# Altium project DE-110817.PrjPcb
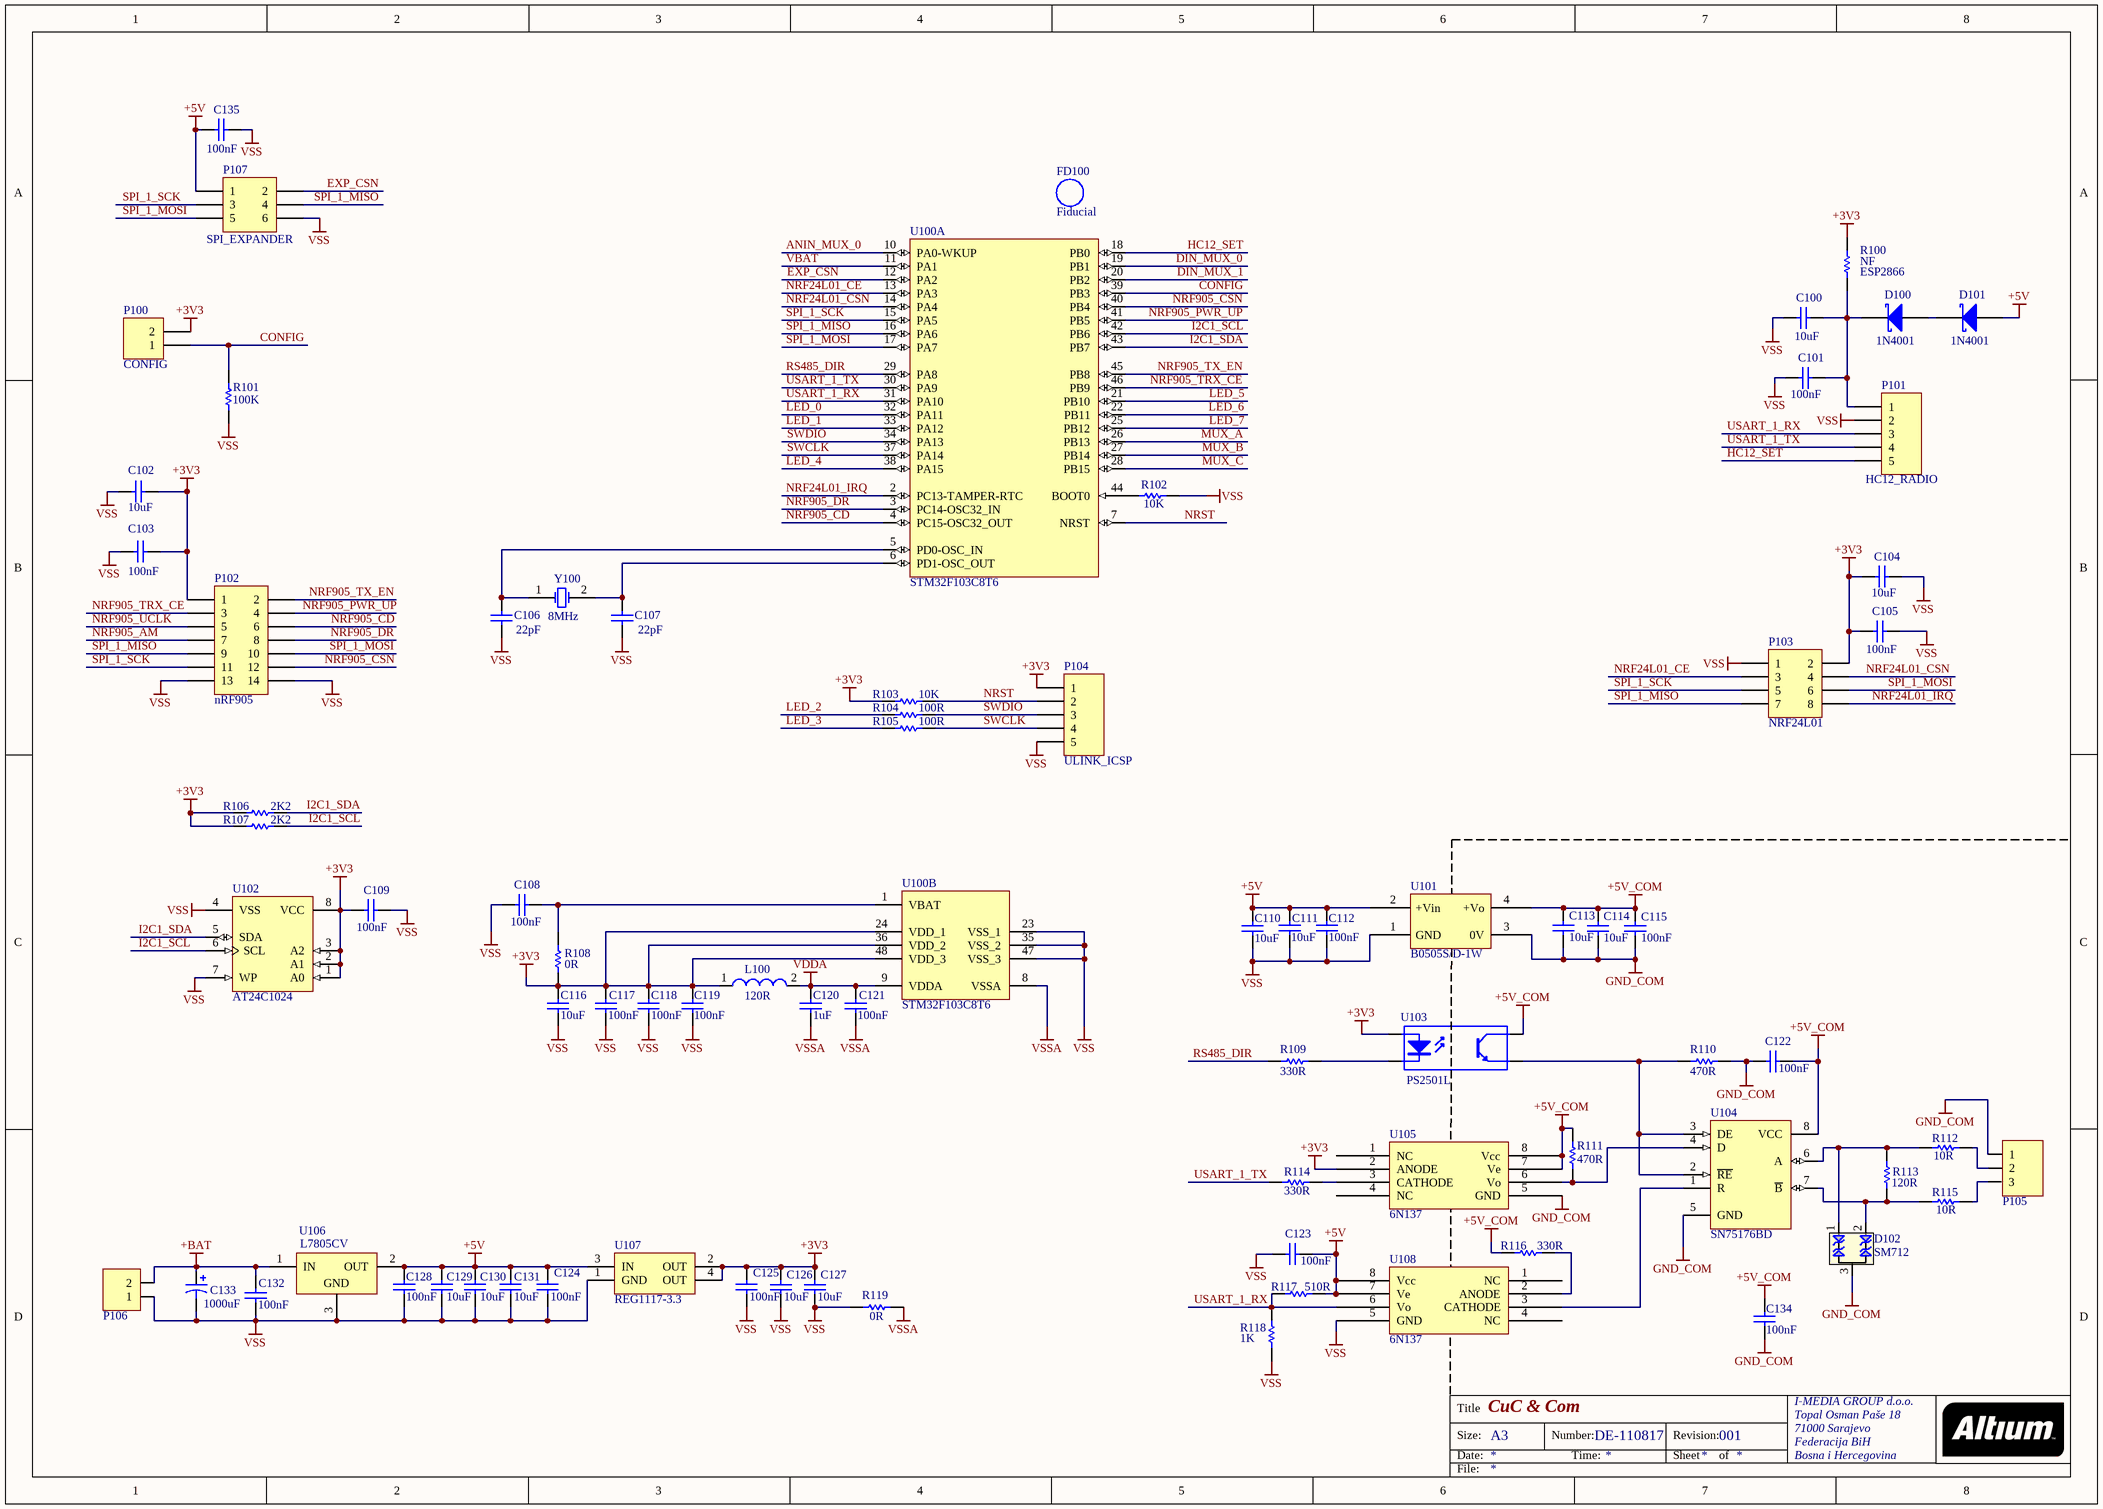
[diagram p0: DE-110817_01.SchDoc]
2 sheets, 204 parts. Net scope: global (net labels, ports and power ports of the same name join across sheets).
Board file: DE-110817.PcbDoc
Sheets:
  DE-110817_01.SchDoc
  DE-110817_02.SchDoc

## Sheet DE-110817_01.SchDoc: CuC & Com
size A3; Author: eldar6776@hotmail.com; DrawnBy: Eldar Dedic; Organization: I-MEDIA GROUP d.o.o.; Address1: Topal Osman Paše 18; Address2: 71000 Sarajevo; Address3: Federacija BiH; Address4: Bosna i Hercegovina; DocumentNumber: DE-110817; Revision: 001

### Parts
C100  10uF  [0805]
C101  100nF  [0603]
C102  10uF  [0805]
C103  100nF  [0603]
C104  10uF  [0805]
C105  100nF  [0603]
C106  22pF  [0603]
C107  22pF  [0603]
C108  100nF  [0603]
C109  100nF  [0603]
C110  10uF  [0805]
C111  10uF  [0805]
C112  100nF  [0603]
C113  10uF  [0805]
C114  10uF  [0805]
C115  100nF  [0603]
C116  10uF  [0805]
C117  100nF  [0603]
C118  100nF  [0603]
C119  100nF  [0603]
C120  1uF  [0603]
C121  100nF  [0603]
C122  100nF  [0603]
C123  100nF  [0603]
C124  100nF  [0603]
C125  100nF  [0603]
C126  10uF  [0805]
C127  10uF  [0805]
C128  100nF  [0603]
C129  10uF  [0805]
C130  10uF  [0805]
C131  10uF  [0805]
C132  100nF  [0603]
C133  1000uF  [CAPPR5-10x16]
C134  100nF  [0603]
C135  100nF  [0603]
D100  1N4001  [SMA]
D101  1N4001  [SMA]
D102  SM712  [SOT23_3L]
FD100  Fiducial  [Fiducial]  (no BOM)
L100  120R  [SMD-0805]
P100  CONFIG  [HDR1X2]
P101  HC12_RADIO  [HDR1X5]
P102  nRF905  [HDR2X7]
P103  NRF24L01  [HDR2X4]
P104  ULINK_ICSP  [HDR1X5]
P105  TERMINAL BLOK 3  [TERMINAL BLOK 3]  (value not drawn)
P106  TERMINAL BLOK 2  [TERMINAL BLOK 2]  (value not drawn)
P107  SPI_EXPANDER  [HDR2X3]
R100  NF  [ERA-0603]
R101  100K  [ERA-0603]
R102  10K  [ERA-0603]
R103  10K  [ERA-0603]
R104  100R  [ERA-0603]
R105  100R  [ERA-0603]
R106  2K2  [ERA-0603]
R107  2K2  [ERA-0603]
R108  0R  [ERA-0603]
R109  330R  [ERA-0603]
R110  470R  [ERA-0603]
R111  470R  [ERA-0603]
R112  10R  [ERA-0805]
R113  120R  [ERA-0805]
R114  330R  [ERA-0603]
R115  10R  [ERA-0805]
R116  330R  [ERA-0603]
R117  510R  [ERA-0603]
R118  1K  [ERA-0603]
R119  0R  [ERA-0603]
U100  STM32F103C8T6  [STM-LQFP48_N]  (parts A,B of 2)
U101  B0505S/D-1W  [B0505S-1W]
U102  AT24C1024  [SOIC-SN8_N]
U103  PS2501L  [SOP4]
U104  SN75176BD  [D008_L]
U105  6N137  [SMD-8]
U106  L7805CV  [TO220ABN]
U107  REG1117-3.3  [ZZ311]
U108  6N137  [SMD-8]
Y100  8MHz  [HC49/4H_SMX]

### Nets
+3V3: C102.1 C103.1 C104.1 C105.1 C109.1 C116.2 C117.2 C118.2 C119.2 C125.2 C126.2 C127.2 L100.1 P100.2 P102.1 P103.2 P104.1 R100.2 R103.2 R106.1 R107.1 R108.2 U100.24(VDD_1) U100.36(VDD_2) U100.48(VDD_3) U102.1(A0) U102.2(A1) U102.3(A2) U102.8(VCC) U103.1(A) U105.2(ANODE) U107.2(OUT) U107.4(OUT)
+5V: C110.2 C111.2 C112.2 C123.1 C124.2 C128.2 C129.2 C130.2 C131.2 C135.2 D101.1(A) P107.1 R117.1 U101.2(+Vin) U106.2(OUT) U107.3(IN) U108.7(Ve) U108.8(Vcc)
+5V_COM: C113.2 C114.2 C115.2 C122.2 C134.1 R111.1 R116.2 U101.4(+Vo) U103.4(C) U104.8(VCC) U105.7(Ve) U105.8(Vcc)
+BAT: C132.2 C133.1 P106.2 U106.1(IN)
GND_COM: C113.1 C114.1 C115.1 C122.1 C134.2 D102.3(GND) P105.1 R110.2 U101.3(0V) U104.5(GND) U105.5(GND)
VDDA: C120.2 C121.2 L100.2 U100.9(VDDA)
VSS: C100.2 C101.2 C102.2 C103.2 C104.2 C105.2 C106.1 C107.1 C108.2 C109.2 C110.1 C111.1 C112.1 C116.1 C117.1 C118.1 C119.1 C123.2 C124.1 C125.1 C126.1 C127.1 C128.1 C129.1 C130.1 C131.1 C132.1 C133.2 C135.1 P101.2 P102.13 P102.14 P103.1 P104.5 P106.1 P107.6 R101.1 R102.2 R118.1 R119.1 U100.23(VSS_1) U100.35(VSS_2) U100.47(VSS_3) U101.1(GND) U102.4(VSS) U102.7(WP) U106.3(GND) U107.1(GND) U108.5(GND)
VSSA: C120.1 C121.1 R119.2 U100.8(VSSA)
ANIN_MUX_0: U100.10(PA0-WKUP)
CONFIG: P100.1 R101.2 U100.39(PB3)
DIN_MUX_0: U100.19(PB1)
DIN_MUX_1: U100.20(PB2)
EXP_CSN: P107.2 U100.12(PA2)
HC12_SET: P101.5 U100.18(PB0)
I2C1_SCL: R107.2 U100.42(PB6) U102.6(SCL)
I2C1_SDA: R106.2 U100.43(PB7) U102.5(SDA)
LED_0: U100.32(PA11)
LED_1: U100.33(PA12)
LED_2: R104.2
LED_3: R105.2
LED_4: U100.38(PA15)
LED_5: U100.21(PB10)
LED_6: U100.22(PB11)
LED_7: U100.25(PB12)
MUX_A: U100.26(PB13)
MUX_B: U100.27(PB14)
MUX_C: U100.28(PB15)
NRF24L01_CE: P103.3 U100.13(PA3)
NRF24L01_CSN: P103.4 U100.14(PA4)
NRF24L01_IRQ: P103.8 U100.2(PC13-TAMPER-RTC)
NRF905_AM: P102.7
NRF905_CD: P102.6 U100.4(PC15-OSC32_OUT)
NRF905_CSN: P102.12 U100.40(PB4)
NRF905_DR: P102.8 U100.3(PC14-OSC32_IN)
NRF905_PWR_UP: P102.4 U100.41(PB5)
NRF905_TRX_CE: P102.3 U100.46(PB9)
NRF905_TX_EN: P102.2 U100.45(PB8)
NRF905_UCLK: P102.5
NRST: P104.2 R103.1 U100.7(NRST)
RS485_DIR: R109.2 U100.29(PA8)
SPI_1_MISO: P102.9 P103.7 P107.4 U100.16(PA6)
SPI_1_MOSI: P102.10 P103.6 P107.5 U100.17(PA7)
SPI_1_SCK: P102.11 P103.5 P107.3 U100.15(PA5)
SWCLK: P104.4 R105.1 U100.37(PA14)
SWDIO: P104.3 R104.1 U100.34(PA13)
USART_1_RX: P101.3 R117.2 R118.2 U100.31(PA10) U108.6(Vo)
USART_1_TX: P101.4 R114.1 U100.30(PA9)
VBAT: U100.11(PA1)
NetC100_1: C100.1 C101.1 D100.2(K) P101.1 R100.1
NetC106_2: C106.2 U100.5(PD0-OSC_IN) Y100.1(OSC1)
NetC107_2: C107.2 U100.6(PD1-OSC_OUT) Y100.2(OSC2)
NetC108_1: C108.1 R108.1 U100.1(VBAT)
NetD100_1: D100.1(A) D101.2(K)
NetD102_1: D102.1(I/O) R112.1 R113.2 U104.6(A)
NetD102_2: D102.2(I/O) R113.1 R115.1 U104.7(~{B})
NetP105_2: P105.2 R112.2
NetP105_3: P105.3 R115.2
NetR102_1: R102.1 U100.44(BOOT0)
NetR109_1: R109.1 U103.2(K)
NetR110_1: R110.1 U103.3(E) U104.2(~{RE}) U104.3(DE)
NetR111_2: R111.2 U104.4(D) U105.6(Vo)
NetR114_2: R114.2 U105.3(CATHODE)
NetR116_1: R116.1 U108.2(ANODE)
NetU104_1: U104.1(R) U108.3(CATHODE)

Not connected (* = marked no-connect by the designer): U105 1(NC) 4(NC); U108 1(NC) 4(NC)

### Notes on the sheet
- (near R100) ESP2866
- Title
- Size:
- Date:
- A3
- Number:
- Time:
- Revision:
- Sheet
- of
- File:

### Library data of the parts
C100 C102 C104 C110 C111 C113 C114 C116 C126 C127 C129-C131 = C0805: Ceramic Chip Capacitor - Standard; Note: Footprint corresponds to dimensions for bulk cassette packaging. This case size has tightened tolerances.; Published: 17-Jul-2002; LatestRevisionDate: 19-Mar-2004; LatestRevisionNote: Silkscreen size reduced.; DatasheetDocument: Mar-2001; PackageDocument: Mar-2001; PackageReference: 0805; Publisher: Altium Limited; Code_JEITA: 0805; Code_IPC: 2012[0805]; ComponentLink1Description: Manufacturer Link; ComponentLink1URL: http://www.kemet.com/; ComponentLink2Description: Datasheet; ComponentLink2URL: http://www.kemet.com/kemet/web/homepage/kechome.nsf/vapubfilesname/F3102TA.pdf/$file/F3102TA.pdf
  C100 C102 C104 C116: Value: 10uF
C101 C103 C105-C109 C112 C115 C117-C125 C128 C132 C134 C135 = C0603: Ceramic Chip Capacitor - Standard; Note: Footprint corresponds to dimensions for bulk cassette packaging. This case size has tightened tolerances.; Published: 17-Jul-2002; LatestRevisionDate: 19-Mar-2004; LatestRevisionNote: Silkscreen size reduced.; DatasheetDocument: Mar-2001; PackageDocument: Mar-2001; PackageReference: 0603; Publisher: Altium Limited; Code_JEITA: 0603; Code_IPC: 1608 [0603]; ComponentLink1Description: Manufacturer Link; ComponentLink1URL: http://www.kemet.com/; ComponentLink2Description: Datasheet; ComponentLink2URL: http://www.kemet.com/kemet/web/homepage/kechome.nsf/vapubfilesname/F3102TA.pdf/$file/F3102TA.pdf
  C101 C103 C105 C108 C109 C117-C119 C121 C132: Value: 100nF
  C106 C107: Value: 22pF
  C120: Value: 1uF
C133 = EKA00DD410D00: Aluminum Electrolytic Capacitor, Radial Style with Long Leads: 1000uF, 16V; Note: Refer to Manufacturer's Data Sheets for other lead formations; DrillSize: Nominal, Rounded To The Nearest 0.1mm; Published: 19-Mar-2004; DatasheetDocument: 20-Feb-2001; PackageReference: CAPPR5-10X16; Publisher: Altium Limited; ComponentLink1Description: Manufacturer Link; ComponentLink1URL: http://www.vishay.com/; ComponentLink2Description: Datasheet; ComponentLink2URL: http://www.vishay.com/docs/25014/eka.pdf; Value: 1000uF
D100 D101 = 10MQ060N: Schottky Rectifier; Published: 17-Sep-2003; DatasheetVersion: May-2002; PackageVersion: revH, May-2002; PackageReference: SMA; Publisher: Altium Limited; PackageDescription: DO-214-AC/SMA; 2 C-Bend Leads; Body 5 x 2.7 mm, inc. leads (LxW); ComponentLink1Description: Manufacturer Link; ComponentLink1URL: http://www.irf.com/; ComponentLink2Description: Datasheet; ComponentLink2URL: http://www.irf.com/product-info/datasheets/data/10MQ060N.pdf
D102 = 824022: TVS Diode WE-TVS-Standard, VRWM=5.0V; Reverse Stand Off Voltage: 5V; PackageReference: SOT23_3L; PartNumber: 824022; ComponentLink1Description: Manufacturer URL; ComponentLink1URL: http://www.we-online.com; ComponentLink2Description: Datasheet; ComponentLink2URL: http://katalog.we-online.de/kataloge/eisos/media/pdf/824022.pdf
FD100 = Fiduchial: Fiduchial mark
L100 = 74279202: SMD EMI Suppression Ferrite Bead WE-CBF, Z = 120 Ohm; Impedance: 120 Ohm; DatasheetVersion: Dec-2005; PackageReference: SMD-0805; PackageDescription: Chip Inductor, 2-Leads, Body 2.0 x 1.2 mm; PartNumber: 74279202; ComponentLink1Description: Manufacturer URL; ComponentLink1URL: http://www.we-online.com; ComponentLink2Description: Datasheet; ComponentLink2URL: http://www.we-online.de/katalog/media/pdf/74279202.pdf
P100 = Header 2: Header, 2-Pin; LatestRevisionDate: 17-Jul-2002; LatestRevisionNote: Re-released for DXP Platform.; Publisher: Altium Limited
P101 P104 = Header 5: Header, 5-Pin; LatestRevisionDate: 17-Jul-2002; LatestRevisionNote: Re-released for DXP Platform.; Publisher: Altium Limited
P102 = Header 7X2: Header, 7-Pin, Dual row; LatestRevisionDate: 17-Jul-2002; LatestRevisionNote: Re-released for DXP Platform.; Publisher: Altium Limited
P103 = Header 4X2: Header, 4-Pin, Dual row; LatestRevisionDate: 17-Jul-2002; LatestRevisionNote: Re-released for DXP Platform.; Publisher: Altium Limited
P105 = TERMINAL BLOK 3: 3 pinski terminal blok konektor
P106 = TERMINAL BLOK 2: 2 pinski terminal blok
P107 = Header 3X2: Header, 3-Pin, Dual row; LatestRevisionDate: 17-Jul-2002; LatestRevisionNote: Re-released for DXP Platform.; Publisher: Altium Limited
R100 R109-R111 R116-R119 = ERAV: Metal Film Thermosensitive Chip Resistor, 0.56 Ohm to 10k Ohm Range, 5% Tolerance, 0603 Size, 0.063 W; Note: If flow soldering, adjust pad width of PCB Footprint to 0.7 - 0.8 times the width of the resistor.; Published: 17-Dec-2003; LatestRevisionDate: 19-Mar-2004; LatestRevisionNote: Silkscreen size reduced.; PackageDocument: Mar-2003; PackageReference: ERA-0603; Publisher: Altium Limited; Code_IPC: 1608 [0603]; ComponentLink1Description: Manufacturer Link; ComponentLink1URL: http://www.panasonic.com/industrial/components/resistive_products.htm; ComponentLink2Description: Datasheet; ComponentLink2URL: http://www.panasonic.com/industrial/components/pdf/AOF0000CE1.pdf
R101-R108 R114 = ERA3Y: Rectangular Thick Film Chip Resistor, 10 Ohm to 330k Ohm Range, 0.1% and 0.5% Tolerance, 0603 Size, 0.063 W; Note: If flow soldering, adjust pad width of PCB Footprint to 0.7 - 0.8 times the width of the resistor.; Published: 17-Dec-2003; LatestRevisionDate: 19-Mar-2004; LatestRevisionNote: Silkscreen size reduced.; PackageDocument: Mar-2003; PackageReference: ERA-0603; Publisher: Altium Limited; Code_IPC: 1608 [0603]; ComponentLink1Description: Manufacturer Link; ComponentLink1URL: http://www.panasonic.com/industrial/components/resistive_products.htm; ComponentLink2Description: Datasheet; ComponentLink2URL: http://www.panasonic.com/industrial/components/pdf/AOA0000CE8.pdf
  R101: Value: 100K
  R102 R103: Value: 10K
  R104 R105: Value: 100R
  R106 R107: Value: 2K2
  R108: Value: 0R
  R114: Value: 330R
R112 R113 R115 = ERA6Y: Rectangular Thick Film Chip Resistor, 10 Ohm to 1M Ohm Range, 0.1% and 0.5% Tolerance, 0805 Size, 0.1 W; Note: If flow soldering, adjust pad width of PCB Footprint to 0.7 - 0.8 times the width of the resistor.; Published: 17-Dec-2003; LatestRevisionDate: 19-Mar-2004; LatestRevisionNote: Silkscreen size reduced.; PackageDocument: Mar-2003; PackageReference: ERA-0805; Publisher: Altium Limited; Code_IPC: 2012 [0805]; ComponentLink1Description: Manufacturer Link; ComponentLink1URL: http://www.panasonic.com/industrial/components/resistive_products.htm; ComponentLink2Description: Datasheet; ComponentLink2URL: http://www.panasonic.com/industrial/components/pdf/AOA0000CE8.pdf
  R112 R115: Value: 10R
  R113: Value: 120R
U100 = STM32F103C8T6: ARM Cortex-M3 32-bit MCU, 64 KB Flash, 20 KB Internal RAM, 37 I/Os, 48-pin LQFP, -40 to 85 degC, Tray; A/D Converter: 2x12-bit (10 Channel); FLASH Size (Prog) (kB): 64; I/Os (High Current): 37; Internal RAM Size (kB): 20; Operating Frequency(F) (Processor speed) (MHz): 72; Supply Voltage(Vcc) min (V): 2; DatasheetVersion: Rev. 16; PackageVersion: Rev. 6, 06/2013; PackageReference: LQFP48; PackageDescription: 48-Pin Low Profile Quad Flat Package, 7 x 7 mm Body, 0.5 mm Pitch; Supplier 1: Digi-Key; Supplier Part Number 1: 497-6063-ND; Supplier 2: Farnell; Supplier Part Number 2: 1447637; Supplier 3: Newark; Supplier Part Number 3: 59M2182; Supplier 4: Newark; Supplier Part Number 4: 57P1222; Supplier 5: Mouser; Supplier Part Number 5: 511-STM32F103C8T6; Core: ARM Cortex-M3; Packing: Tray; Mounting Technology: Surface Mount; PartNumber: STM32F103C8T6; ComponentLink1Description: Manufacturer URL; ComponentLink1URL: http://www.st.com/web/en/home.html; ComponentLink2Description: Datasheet; ComponentLink2URL: http://www.st.com/st-web-ui/static/active/en/resource/technical/document/datasheet/CD00161566.pdf; ComponentLink3Description: Package Specification; ComponentLink3URL: http://www.st.com/st-web-ui/static/active/en/resource/technical/document/datasheet/DM00058181.pdf
U101 = B0505S/D: 1W isolated dc dc converter
U102 = 24AA64/SN: 64Kbit, 400kHz, 1.7V, I2C Serial EEPROM, 8-Pin SOIC 150mil, Commercial Temperature; Published: 29-Jan-2009; DatasheetVersion: revQ, Jun-2009; PackageVersion: revBB, Aug-2009; PackageReference: SOIC-SN8; Publisher: Altium Limited; PackageDescription: 8-Lead Plastic Small Outline (SN) - Narrow, 3.90mm Body [SOIC]; Supplier 1: Digi-Key; Supplier Part Number 1: 24AA64/SN-ND; Code_JEDEC: MS-012; Code_IPC: SOIC127P600-8; ComponentLink1Description: Datasheet; ComponentLink1URL: http://ww1.microchip.com/downloads/en/DeviceDoc/21189Q.pdf; ComponentLink2Description: Packaging Specification; ComponentLink2URL: http://www.microchip.com/stellent/groups/techpub_sg/documents/packagingspec/en012702.pdf; ComponentLink3Description: Microchip.com Home; ComponentLink3URL: http://www.microchip.com/
U103 = PC817 optocoupler: 4-Pin Phototransistor Optocoupler; Published: 24-Mar-1999; LatestRevisionDate: 04-Mar-2005; LatestRevisionNote: Sch pins 3 & 4 Swapped.; DatasheetVersion: Nov-2003; PackageReference: DIP-4; Publisher: Altium Limited
U104 = SN75176BD: Differential Bus Transceiver; Note: Receiver Hysteresis of 50mV Typical; Published: 15-May-2002; LatestRevisionDate: 13-Apr-2006; LatestRevisionNote: IPC-7351 Footprint Added.; DatasheetVersion: Sep-1989; PackageVersion: Jan-1998; PackageReference: D008; Publisher: Altium Limited; PackageDescription: 8-Pin Small Outline Integrated Circuit 1.27 mm Pitch; Code_IPC: SOIC127P600-8; ComponentLink1Description: Manufacturer Link; ComponentLink1URL: http://www.ti.com/; ComponentLink2Description: Datasheet; ComponentLink2URL: http://www-s.ti.com/sc/ds/sn75176b.pdf
U105 U108 = 6N137: High CMR, High Speed TTL Compatibile Optocoupler
U106 = L7805CV: Positive Voltage Regulator; Note: Tab is connected to pin 3 (GND).; Published: 24-Aug-2001; LatestRevisionDate: 17-Jul-2002; LatestRevisionNote: Re-released for DXP Platform.; DatasheetVersion: Dec-1998; PackageVersion: Jun-1998; PackageReference: TO220ABN; Publisher: Altium Limited; PackageDescription: TO, Thru-Hole, Vertical, Heatsink Mounted; 3 In-Line Leads; Pitch 2.54 mm; Pin sequence 1, 3, 2; ComponentLink1Description: Manufacturer Link; ComponentLink1URL: http://www.st.com/
U107 = REG1117-3.3: 800mA and 1A Low Dropout Positive Regulator 2.85V, 3.3V, 5V, and Adjustable; Published: 8-Jun-2000; LatestRevisionDate: 17-Jul-2002; LatestRevisionNote: Re-released for DXP Platform.; DatasheetVersion: Sep-1997; PackageVersion: revC; PackageReference: ZZ311; Publisher: Altium Limited; PackageDescription: SOT-223/SC-73; 4 Leads; Body 6.7 x 7.3 mm, inc. leads (LxW max); ComponentLink1Description: Manufacturer Link; ComponentLink1URL: http://www.ti.com/; ComponentLink2Description: Datasheet; ComponentLink2URL: http://www-s.ti.com/sc/ds/REG1117.pdf
Y100 = HC49/4H_SMX: Surface Mount Quartz Crystal; Note: PCB layout complies with manufacturer's recommendation.; Published: 17-Jul-2002; DatasheetDocument: 18-Oct-1999; PackageDocument: 18-Oct-1999; PackageReference: HC49/4H_SMX; Publisher: Altium Limited; ComponentLink1Description: Manufacturer Link; ComponentLink1URL: http://www.cmac.com/mt/; ComponentLink2Description: Datasheet; ComponentLink2URL: http://www.cmac.com/mt/databook/crystals/smd/hc49_4h_smx.pdf

## Sheet DE-110817_02.SchDoc: Digital & Analog IO
size A3; Author: eldar6776@hotmail.com; DrawnBy: Eldar Dedic; Organization: I-MEDIA GROUP d.o.o.; Address1: Topal Osman Paše 18; Address2: 71000 Sarajevo; Address3: Federacija BiH; Address4: Bosna i Hercegovina; DocumentNumber: DE-110717; Revision: 001
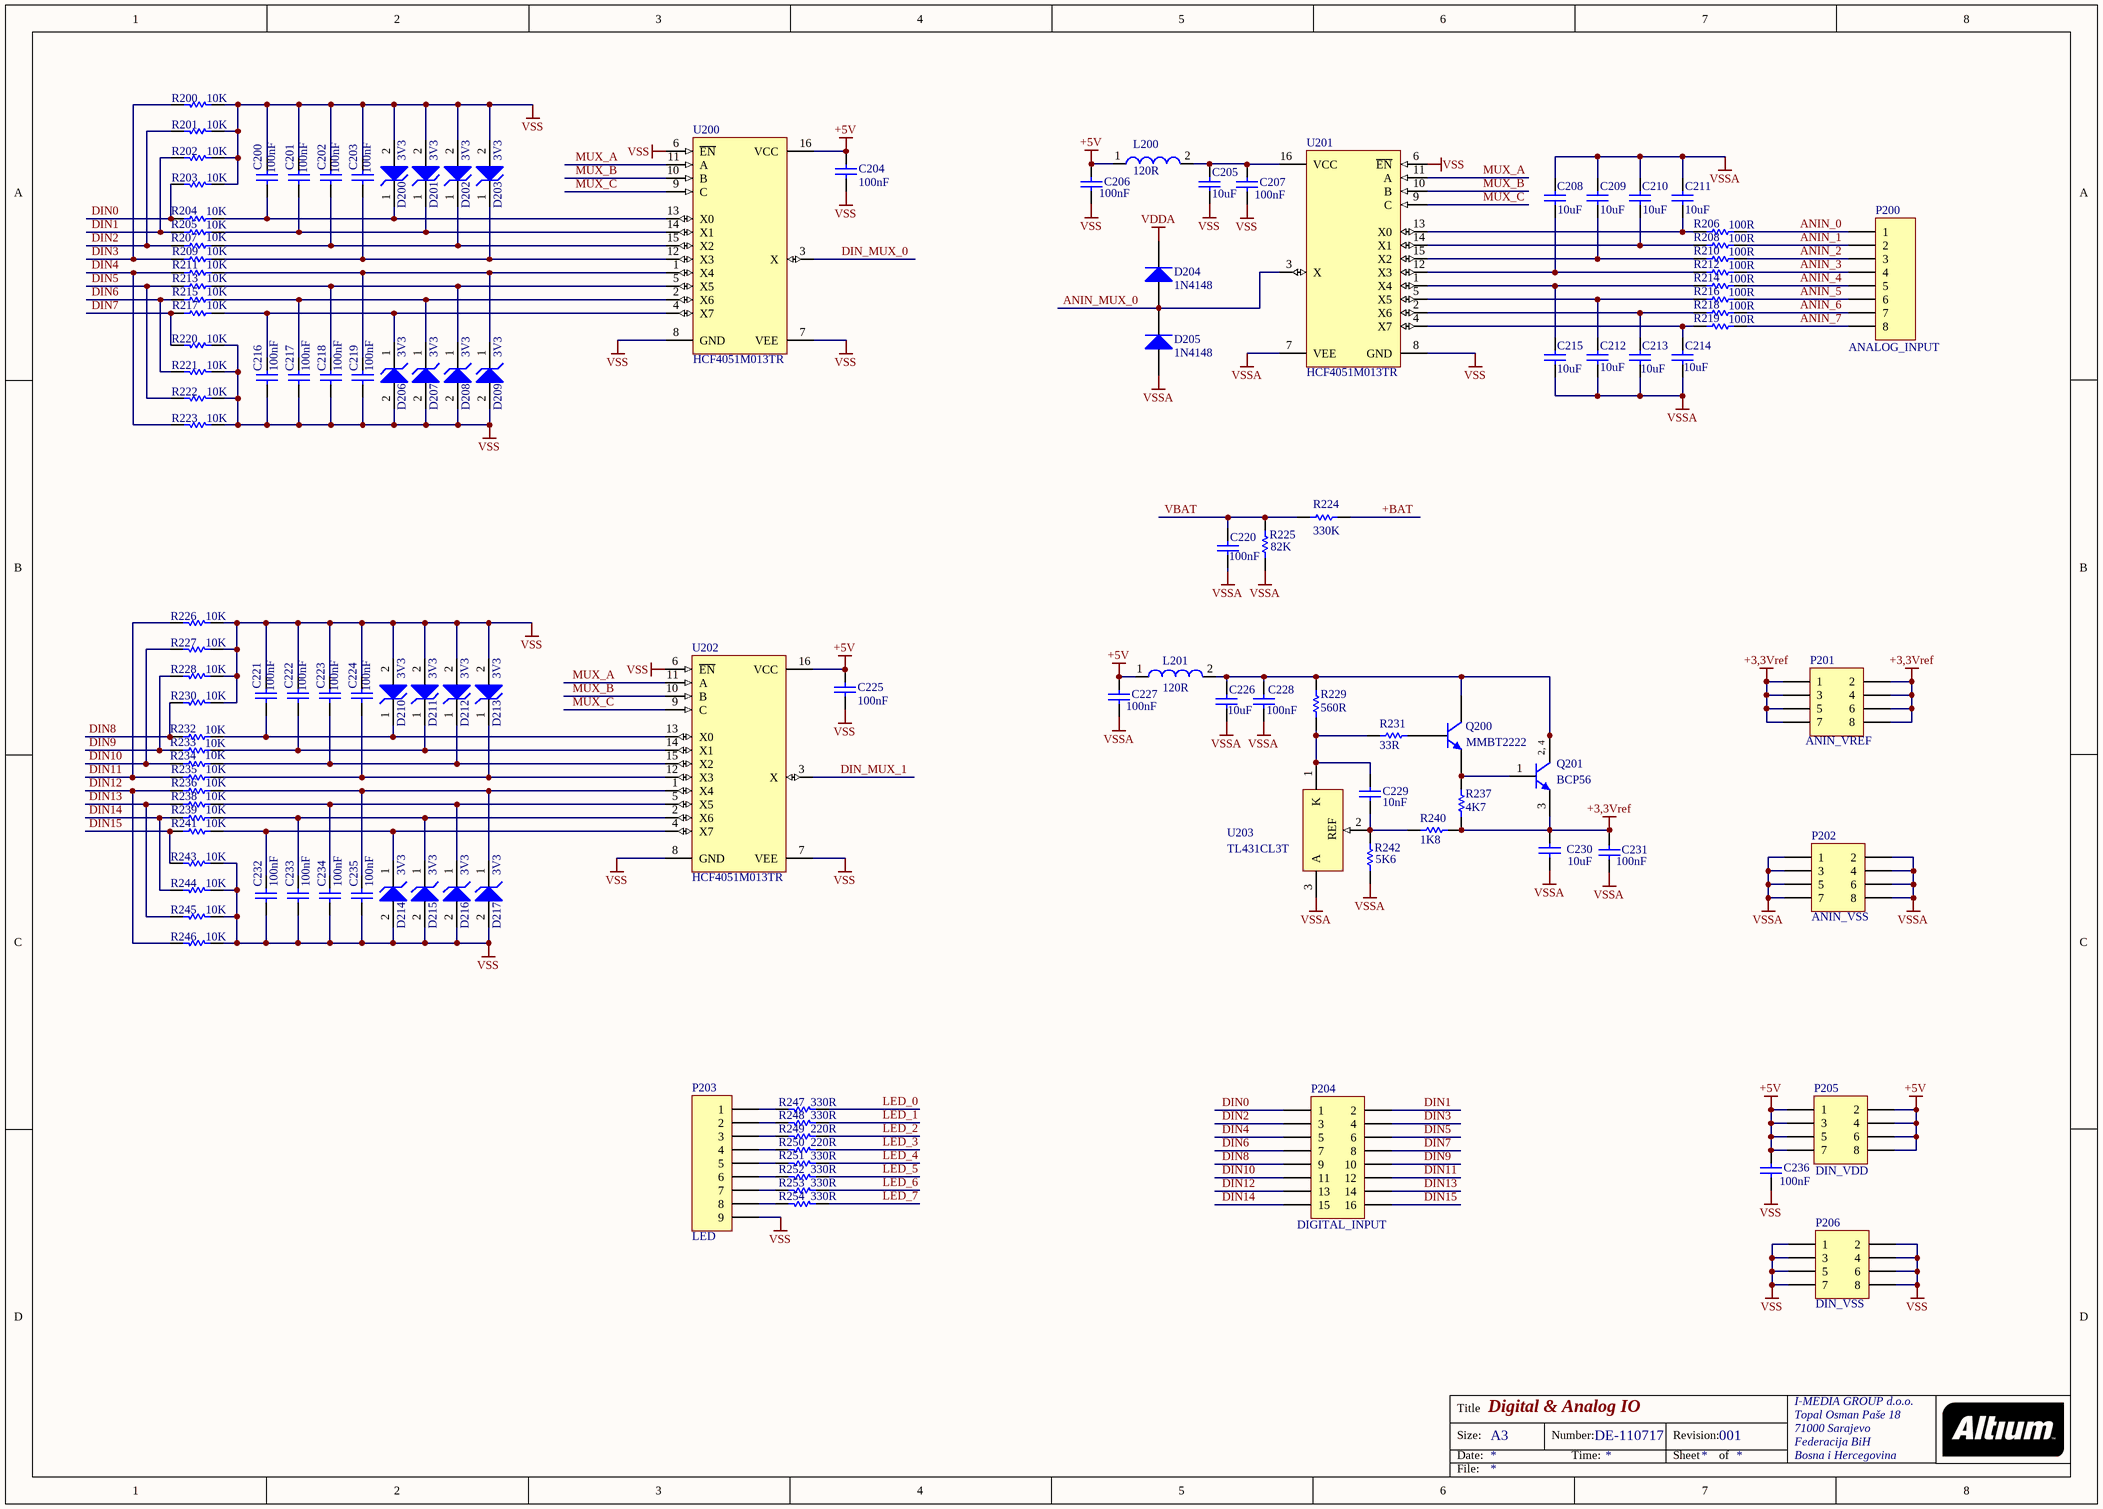
[diagram p1: DE-110817_02.SchDoc]

### Parts
C200  100nF  [0603]
C201  100nF  [0603]
C202  100nF  [0603]
C203  100nF  [0603]
C204  100nF  [0603]
C205  10uF  [0805]
C206  100nF  [0603]
C207  100nF  [0603]
C208  10uF  [0805]
C209  10uF  [0805]
C210  10uF  [0805]
C211  10uF  [0805]
C212  10uF  [0805]
C213  10uF  [0805]
C214  10uF  [0805]
C215  10uF  [0805]
C216  100nF  [0603]
C217  100nF  [0603]
C218  100nF  [0603]
C219  100nF  [0603]
C220  100nF  [0603]
C221  100nF  [0603]
C222  100nF  [0603]
C223  100nF  [0603]
C224  100nF  [0603]
C225  100nF  [0603]
C226  10uF  [0805]
C227  100nF  [0603]
C228  100nF  [0603]
C229  10nF  [0603]
C230  10uF  [0805]
C231  100nF  [0603]
C232  100nF  [0603]
C233  100nF  [0603]
C234  100nF  [0603]
C235  100nF  [0603]
C236  100nF  [0603]
D200  3V3  [ONSC-SOD-323-2-477-02_V]
D201  3V3  [ONSC-SOD-323-2-477-02_V]
D202  3V3  [ONSC-SOD-323-2-477-02_V]
D203  3V3  [ONSC-SOD-323-2-477-02_V]
D204  1N4148  [SOD323]
D205  1N4148  [SOD323]
D206  3V3  [ONSC-SOD-323-2-477-02_V]
D207  3V3  [ONSC-SOD-323-2-477-02_V]
D208  3V3  [ONSC-SOD-323-2-477-02_V]
D209  3V3  [ONSC-SOD-323-2-477-02_V]
D210  3V3  [ONSC-SOD-323-2-477-02_V]
D211  3V3  [ONSC-SOD-323-2-477-02_V]
D212  3V3  [ONSC-SOD-323-2-477-02_V]
D213  3V3  [ONSC-SOD-323-2-477-02_V]
D214  3V3  [ONSC-SOD-323-2-477-02_V]
D215  3V3  [ONSC-SOD-323-2-477-02_V]
D216  3V3  [ONSC-SOD-323-2-477-02_V]
D217  3V3  [ONSC-SOD-323-2-477-02_V]
L200  120R  [SMD-0805]
L201  120R  [SMD-0805]
P200  ANALOG_INPUT  [HDR1X8]
P201  ANIN_VREF  [HDR2X4]
P202  ANIN_VSS  [HDR2X4]
P203  LED  [HDR1X9]
P204  DIGITAL_INPUT  [HDR2X8]
P205  DIN_VDD  [HDR2X4]
P206  DIN_VSS  [HDR2X4]
Q200  MMBT2222  [318-08]
Q201  BCP56  [SOT223_N]
R200  10K  [ERA-0603]
R201  10K  [ERA-0603]
R202  10K  [ERA-0603]
R203  10K  [ERA-0603]
R204  10K  [ERA-0603]
R205  10K  [ERA-0603]
R206  100R  [ERA-0603]
R207  10K  [ERA-0603]
R208  100R  [ERA-0603]
R209  10K  [ERA-0603]
R210  100R  [ERA-0603]
R211  10K  [ERA-0603]
R212  100R  [ERA-0603]
R213  10K  [ERA-0603]
R214  100R  [ERA-0603]
R215  10K  [ERA-0603]
R216  100R  [ERA-0603]
R217  10K  [ERA-0603]
R218  100R  [ERA-0603]
R219  100R  [ERA-0603]
R220  10K  [ERA-0603]
R221  10K  [ERA-0603]
R222  10K  [ERA-0603]
R223  10K  [ERA-0603]
R224  330K  [ERA-0603]
R225  82K  [ERA-0603]
R226  10K  [ERA-0603]
R227  10K  [ERA-0603]
R228  10K  [ERA-0603]
R229  560R  [ERA-0603]
R230  10K  [ERA-0603]
R231  33R  [ERA-0603]
R232  10K  [ERA-0603]
R233  10K  [ERA-0603]
R234  10K  [ERA-0603]
R235  10K  [ERA-0603]
R236  10K  [ERA-0603]
R237  4K7  [ERA-0603]
R238  10K  [ERA-0603]
R239  10K  [ERA-0603]
R240  1K8  [ERA-0603]
R241  10K  [ERA-0603]
R242  5K6  [ERA-0603]
R243  10K  [ERA-0603]
R244  10K  [ERA-0603]
R245  10K  [ERA-0603]
R246  10K  [ERA-0603]
R247  330R  [ERA-0603]
R248  330R  [ERA-0603]
R249  220R  [ERA-0603]
R250  220R  [ERA-0603]
R251  330R  [ERA-0603]
R252  330R  [ERA-0603]
R253  330R  [ERA-0603]
R254  330R  [ERA-0603]
U200  HCF4051M013TR  [M16A_N]
U201  HCF4051M013TR  [M16A_N]
U202  HCF4051M013TR  [M16A_N]
U203  TL431CL3T  [SOT23-3_N]

### Nets
+3,3Vref: C230.2 C231.2 P201.1 P201.2 P201.3 P201.4 P201.5 P201.6 P201.7 P201.8 Q201.3(E) R237.2 R240.2
+5V: C204.2 C206.2 C225.2 C227.2 C236.2 L200.1 L201.1 P205.1 P205.2 P205.3 P205.4 P205.5 P205.6 P205.7 P205.8 U200.16(VCC) U202.16(VCC)
+BAT: R224.2
VDDA: D204.1(K)
VSS: C200.1 C201.1 C202.1 C203.1 C204.1 C205.1 C206.1 C207.1 C216.1 C217.1 C218.1 C219.1 C221.1 C222.1 C223.1 C224.1 C225.1 C232.1 C233.1 C234.1 C235.1 C236.1 D200.2(A) D201.2(A) D202.2(A) D203.2(A) D206.2(A) D207.2(A) D208.2(A) D209.2(A) D210.2(A) D211.2(A) D212.2(A) D213.2(A) D214.2(A) D215.2(A) D216.2(A) D217.2(A) P203.9 P206.1 P206.2 P206.3 P206.4 P206.5 P206.6 P206.7 P206.8 R200.1 R201.1 R202.1 R203.1 R220.1 R221.1 R222.1 R223.1 R226.1 R227.1 R228.1 R230.1 R243.1 R244.1 R245.1 R246.1 U200.6(~{EN}) U200.7(VEE) U200.8(GND) U201.6(~{EN}) U201.8(GND) U202.6(~{EN}) U202.7(VEE) U202.8(GND)
VSSA: C208.1 C209.1 C210.1 C211.1 C212.1 C213.1 C214.1 C215.1 C220.1 C226.1 C227.1 C228.1 C230.1 C231.1 D205.2(A) P202.1 P202.2 P202.3 P202.4 P202.5 P202.6 P202.7 P202.8 R225.1 R242.2 U201.7(VEE) U203.3(A)
ANIN_0: P200.1 R206.2
ANIN_1: P200.2 R208.2
ANIN_2: P200.3 R210.2
ANIN_3: P200.4 R212.2
ANIN_4: P200.5 R214.2
ANIN_5: P200.6 R216.2
ANIN_6: P200.7 R218.2
ANIN_7: P200.8 R219.2
ANIN_MUX_0: D204.2(A) D205.1(K) U201.3(X)
DIN0: P204.1 R203.2 R204.1
DIN1: P204.2 R202.2 R205.1
DIN2: P204.3 R201.2 R207.1
DIN3: P204.4 R200.2 R209.1
DIN4: P204.5 R211.1 R223.2
DIN5: P204.6 R213.1 R222.2
DIN6: P204.7 R215.1 R221.2
DIN7: P204.8 R217.1 R220.2
DIN8: P204.9 R230.2 R232.1
DIN9: P204.10 R228.2 R233.1
DIN10: P204.11 R227.2 R234.1
DIN11: P204.12 R226.2 R235.1
DIN12: P204.13 R236.1 R246.2
DIN13: P204.14 R238.1 R245.2
DIN14: P204.15 R239.1 R244.2
DIN15: P204.16 R241.1 R243.2
DIN_MUX_0: U200.3(X)
DIN_MUX_1: U202.3(X)
LED_0: R247.2
LED_1: R248.2
LED_2: R249.2
LED_3: R250.2
LED_4: R251.2
LED_5: R252.2
LED_6: R253.2
LED_7: R254.2
MUX_A: U200.11(A) U201.11(A) U202.11(A)
MUX_B: U200.10(B) U201.10(B) U202.10(B)
MUX_C: U200.9(C) U201.9(C) U202.9(C)
VBAT: C220.2 R224.1 R225.2
NetC200_2: C200.2 D200.1(K) R204.2 U200.13(X0)
NetC201_2: C201.2 D201.1(K) R205.2 U200.14(X1)
NetC202_2: C202.2 D202.1(K) R207.2 U200.15(X2)
NetC203_2: C203.2 D203.1(K) R209.2 U200.12(X3)
NetC205_2: C205.2 C207.2 L200.2 U201.16(VCC)
NetC208_2: C208.2 R212.1 U201.12(X3)
NetC209_2: C209.2 R210.1 U201.15(X2)
NetC210_2: C210.2 R208.1 U201.14(X1)
NetC211_2: C211.2 R206.1 U201.13(X0)
NetC212_2: C212.2 R216.1 U201.5(X5)
NetC213_2: C213.2 R218.1 U201.2(X6)
NetC214_2: C214.2 R219.1 U201.4(X7)
NetC215_2: C215.2 R214.1 U201.1(X4)
NetC216_2: C216.2 D206.1(K) R217.2 U200.4(X7)
NetC217_2: C217.2 D207.1(K) R215.2 U200.2(X6)
NetC218_2: C218.2 D208.1(K) R213.2 U200.5(X5)
NetC219_2: C219.2 D209.1(K) R211.2 U200.1(X4)
NetC221_2: C221.2 D210.1(K) R232.2 U202.13(X0)
NetC222_2: C222.2 D211.1(K) R233.2 U202.14(X1)
NetC223_2: C223.2 D212.1(K) R234.2 U202.15(X2)
NetC224_2: C224.2 D213.1(K) R235.2 U202.12(X3)
NetC226_2: C226.2 C228.2 L201.2 Q200.3(C) Q201.2(C) Q201.4(C) R229.2
NetC229_1: C229.1 R229.1 R231.2 U203.1(K)
NetC229_2: C229.2 R240.1 R242.1 U203.2(REF)
NetC232_2: C232.2 D214.1(K) R241.2 U202.4(X7)
NetC233_2: C233.2 D215.1(K) R239.2 U202.2(X6)
NetC234_2: C234.2 D216.1(K) R238.2 U202.5(X5)
NetC235_2: C235.2 D217.1(K) R236.2 U202.1(X4)
NetP203_1: P203.1 R247.1
NetP203_2: P203.2 R248.1
NetP203_3: P203.3 R249.1
NetP203_4: P203.4 R250.1
NetP203_5: P203.5 R251.1
NetP203_6: P203.6 R252.1
NetP203_7: P203.7 R253.1
NetP203_8: P203.8 R254.1
NetQ200_1: Q200.1(B) R231.1
NetQ200_2: Q200.2(E) Q201.1(B) R237.1

### Notes on the sheet
- Title
- Size:
- Date:
- A3
- Number:
- Time:
- Revision:
- Sheet
- of
- File:
- (in symbol BCP56) 2, 4

### Library data of the parts
C200-C204 C206 C207 C216-C225 C227-C229 C231-C236 = C0603: as C101 on sheet DE-110817_01; Published: 17-Jul-2002; LatestRevisionDate: 19-Mar-2004; LatestRevisionNote: Silkscreen size reduced.; DatasheetDocument: Mar-2001; PackageDocument: Mar-2001; PackageReference: 0603; Publisher: Altium Limited; Code_JEITA: 0603; Code_IPC: 1608 [0603]; ComponentLink1Description: Manufacturer Link; ComponentLink1URL: http://www.kemet.com/; ComponentLink2Description: Datasheet; ComponentLink2URL: http://www.kemet.com/kemet/web/homepage/kechome.nsf/vapubfilesname/F3102TA.pdf/$file/F3102TA.pdf
  C204 C206 C207 C225 C227 C228 C231 C236: Value: 100nF
  C229: Value: 10nF
C205 C208-C215 C226 C230 = C0805: as C100 on sheet DE-110817_01; Published: 17-Jul-2002; LatestRevisionDate: 19-Mar-2004; LatestRevisionNote: Silkscreen size reduced.; DatasheetDocument: Mar-2001; PackageDocument: Mar-2001; PackageReference: 0805; Publisher: Altium Limited; Code_JEITA: 0805; Code_IPC: 2012[0805]; ComponentLink1Description: Manufacturer Link; ComponentLink1URL: http://www.kemet.com/; ComponentLink2Description: Datasheet; ComponentLink2URL: http://www.kemet.com/kemet/web/homepage/kechome.nsf/vapubfilesname/F3102TA.pdf/$file/F3102TA.pdf; Value: 10uF
D200-D203 D206-D217 = MM3Z33VT1G: Zener Voltage Regulator, 300 mW, 2-Pin SOD-323, Pb-Free, Tape and Reel; Manufacturer: On Semiconductor; P Max (W): 0.3; VZ Typ (V): 33; DatasheetVersion: Rev. 9; PackageVersion: Rev. H, 03/2007; PackageReference: SOD-323-2-477-02; PackageDescription: 2-Pin SOD, Body 1.7 x 1.25 mm; Supplier 1: Digi-Key; Supplier Part Number 1: MM3Z33VT1GOSTR-ND; Supplier 2: Digi-Key; Supplier Part Number 2: MM3Z33VT1GOSCT-ND; Supplier 3: Digi-Key; Supplier Part Number 3: MM3Z33VT1GOSDKR-ND; Supplier 4: Farnell; Supplier Part Number 4: 1431197RL; Supplier 5: Farnell; Supplier Part Number 5: 1431197; Supplier 6: Newark; Supplier Part Number 6: 98H0837; Supplier 7: Mouser; Supplier Part Number 7: 863-MM3Z33VT1G; Packing: Tape and Reel; RoHS: Pb-Free; Mounting Technology: Surface Mount; PartNumber: MM3Z33VT1G; ComponentLink1Description: Manufacturer URL; ComponentLink1URL: http://www.onsemi.com/; ComponentLink2Description: Datasheet; ComponentLink2URL: http://www.onsemi.cn/pub_link/Collateral/MM3Z2V4T1-D.PDF; ComponentLink3Description: Package Specification; ComponentLink3URL: http://www.onsemi.com/pub_link/Collateral/477-02.PDF.1
D204 D205 = BAS321: General-purpose Diode; Published: 17-Sep-2003; LatestRevisionDate: 19-Mar-2004; LatestRevisionNote: Silkscreen size reduced.; DatasheetVersion: 9-Feb-1999; PackageVersion: May-1999; PackageReference: SOD323; Publisher: Altium Limited; PackageDescription: SOD-323/SC-76; 2 Leads; Body 1.7 x 1.3 mm, (LxW); ComponentLink1Description: Manufacturer Link; ComponentLink1URL: http://www.semiconductors.philips.com/; ComponentLink2Description: Datasheet; ComponentLink2URL: http://www.semiconductors.philips.com/acrobat/datasheets/BAS321_2.pdf
L200 L201 = 74279202: as L100 on sheet DE-110817_01; DatasheetVersion: Dec-2005; PackageReference: SMD-0805; PackageDescription: Chip Inductor, 2-Leads, Body 2.0 x 1.2 mm; PartNumber: 74279202; ComponentLink1Description: Manufacturer URL; ComponentLink1URL: http://www.we-online.com; ComponentLink2Description: Datasheet; ComponentLink2URL: http://www.we-online.de/katalog/media/pdf/74279202.pdf
P200 = Header 8: Header, 8-Pin; LatestRevisionDate: 17-Jul-2002; LatestRevisionNote: Re-released for DXP Platform.; Publisher: Altium Limited
P201 P202 P205 P206 = Header 4X2: Header, 4-Pin, Dual row; LatestRevisionDate: 17-Jul-2002; LatestRevisionNote: Re-released for DXP Platform.; Publisher: Altium Limited
P203 = Header 9: Header, 9-Pin; LatestRevisionDate: 17-Jul-2002; LatestRevisionNote: Re-released for DXP Platform.; Publisher: Altium Limited
P204 = Header 8X2: Header, 8-Pin, Dual row; LatestRevisionDate: 17-Jul-2002; LatestRevisionNote: Re-released for DXP Platform.; Publisher: Altium Limited
Q200 = MMBT2222ALT1: General Purpose Transistor NPN Silicon; Published: 29-Sep-2000; LatestRevisionDate: 17-Jul-2002; LatestRevisionNote: Re-released for DXP Platform.; DatasheetVersion: 1996; PackageVersion: 1997; PackageReference: 318-08; Publisher: Altium Limited; PackageDescription: SOT-23; 3 Leads; Body 3.0 x 2.6 mm, inc. leads (LxW max); ComponentLink1Description: Manufacturer Link; ComponentLink1URL: http://www.onsemi.com/site/products/landing?taxonomyID=194; ComponentLink2Description: Datasheet; ComponentLink2URL: http://www.onsemi.com/pub/Collateral/MMBT2222LT1-D.PDF
Q201 = BCP56: NPN Medium Power Transistor; Published: 17-Sep-2003; LatestRevisionDate: 12-Dec-2006; LatestRevisionNote: IPC-7351 Footprint Added.; DatasheetVersion: 10-Oct-2001; PackageVersion: Aug-2001; PackageReference: SOT223; Publisher: Altium Limited; PackageDescription: 4-Pin SOT-223 Package 2.3 mm Pitch, 7 mm Lead Span; ComponentLink1Description: Manufacturer Link; ComponentLink1URL: http://www.semiconductors.philips.com/; ComponentLink2Description: Datasheet; ComponentLink2URL: http://www.semiconductors.philips.com/acrobat/datasheets/BC639_BCP56_BCX56_7.pdf
R200-R254 = ERAV: as R100 on sheet DE-110817_01; Published: 17-Dec-2003; LatestRevisionDate: 19-Mar-2004; LatestRevisionNote: Silkscreen size reduced.; PackageDocument: Mar-2003; PackageReference: ERA-0603; Publisher: Altium Limited; Code_IPC: 1608 [0603]; ComponentLink1Description: Manufacturer Link; ComponentLink1URL: http://www.panasonic.com/industrial/components/resistive_products.htm; ComponentLink2Description: Datasheet; ComponentLink2URL: http://www.panasonic.com/industrial/components/pdf/AOF0000CE1.pdf
U200-U202 = CD4051BCM: 8-Channel Analog Multiplexer/Demultiplexer; Published: 17-Jul-2002; LatestRevisionDate: 13-Apr-2006; LatestRevisionNote: IPC-7351 Footprint Added.; DatasheetVersion: Jan-1999; PackageVersion: 2000; PackageReference: M16A; Publisher: Altium Limited; PackageDescription: 16-Pin Small Outline Integrated Circuit 1.27 mm Pitch; Code_IPC: SOIC127P600-16; ComponentLink1Description: Manufacturer Link; ComponentLink1URL: http://www.fairchildsemi.com/; ComponentLink2Description: Datasheet; ComponentLink2URL: http://www.fairchildsemi.com/ds/CD%2FCD4052BC.pdf
U203 = TL431CL3T: Programmable Voltage Reference, 2.5 to 36V, 3-Pin SOT23-3, Tape and Reel; DatasheetVersion: Oct-2011; PackageVersion: 2011; PackageReference: SOT23-3; PackageDescription: 3-Pin SOT-23 Package 0.95 mm Pitch, 2.4 mm Lead Span; ComponentLink1Description: Manufacturer URL; ComponentLink1URL: http://www.st.com; ComponentLink2Description: Datasheet; ComponentLink2URL: http://www.st.com/internet/com/TECHNICAL_RESOURCES/TECHNICAL_LITERATURE/DATASHEET/CD00000986.pdf

## Nets that join several sheets
+5V: DE-110817_01 (18 pins), DE-110817_02 (17 pins)
+BAT: DE-110817_01 (C132.2 C133.1 P106.2 U106.1), DE-110817_02 (R224.2)
VDDA: DE-110817_01 (C120.2 C121.2 L100.2 U100.9), DE-110817_02 (D204.1)
VSS: DE-110817_01 (49 pins), DE-110817_02 (71 pins)
VSSA: DE-110817_01 (C120.1 C121.1 R119.2 U100.8), DE-110817_02 (27 pins)
ANIN_MUX_0: DE-110817_01 (U100.10), DE-110817_02 (D204.2 D205.1 U201.3)
DIN_MUX_0: DE-110817_01 (U100.19), DE-110817_02 (U200.3)
DIN_MUX_1: DE-110817_01 (U100.20), DE-110817_02 (U202.3)
LED_0: DE-110817_01 (U100.32), DE-110817_02 (R247.2)
LED_1: DE-110817_01 (U100.33), DE-110817_02 (R248.2)
LED_2: DE-110817_01 (R104.2), DE-110817_02 (R249.2)
LED_3: DE-110817_01 (R105.2), DE-110817_02 (R250.2)
LED_4: DE-110817_01 (U100.38), DE-110817_02 (R251.2)
LED_5: DE-110817_01 (U100.21), DE-110817_02 (R252.2)
LED_6: DE-110817_01 (U100.22), DE-110817_02 (R253.2)
LED_7: DE-110817_01 (U100.25), DE-110817_02 (R254.2)
MUX_A: DE-110817_01 (U100.26), DE-110817_02 (U200.11 U201.11 U202.11)
MUX_B: DE-110817_01 (U100.27), DE-110817_02 (U200.10 U201.10 U202.10)
MUX_C: DE-110817_01 (U100.28), DE-110817_02 (U200.9 U201.9 U202.9)
VBAT: DE-110817_01 (U100.11), DE-110817_02 (C220.2 R224.1 R225.2)